# EAGLE design simplePDschematicsv1 (EAGLE 7.5.0)
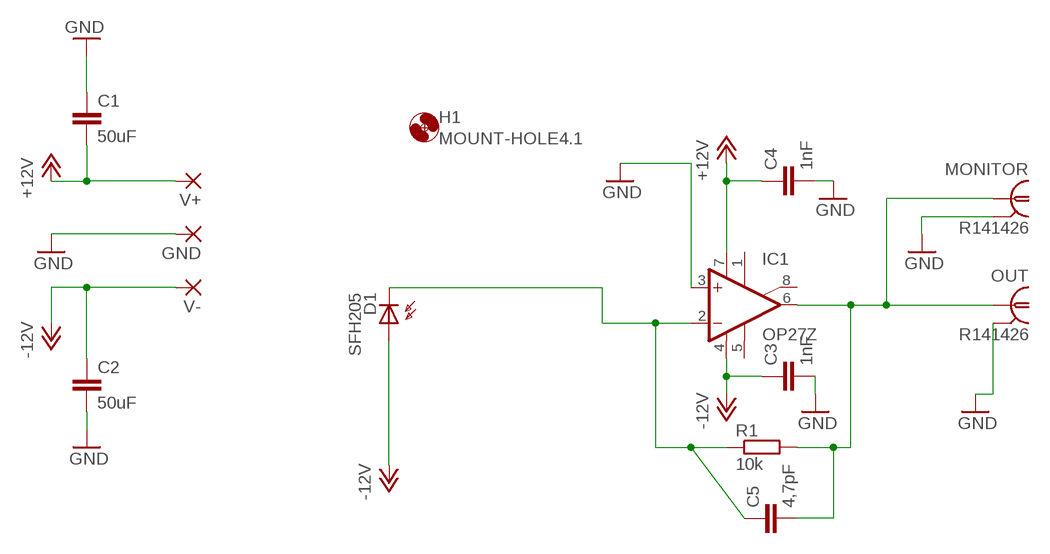
[diagram p0: schematic, sheet 1]

## Parts
C1  50uF  C-EU025-050X050  [C025-050X050]
C2  50uF  C-EU025-050X050  [C025-050X050]
C3  1nF  C-EU025-050X050  [C025-050X050]
C4  1nF  C-EU025-050X050  [C025-050X050]
C5  4,7pF  C-EU025-050X050  [C025-050X050]
D1  SFH205  [SFH205]
GND  1,6/0,9  [1,6/0,9]
H1  MOUNT-HOLE4.1  [4,1]
IC1  OP27Z  [DIL08]
MONITOR  R141426  [R141426]
OUT  R141426  [R141426]
R1  10k  R-EU_0207/5V  [0207/5V]
V+  1,6/0,9  [1,6/0,9]
V-  1,6/0,9  [1,6/0,9]

## Nets
GND: C1.1 C2.2 C3.2 C4.2 GND.1(P) IC1.3(+IN) MONITOR.2 MONITOR.3 MONITOR.4 MONITOR.5 OUT.2 OUT.3 OUT.4 OUT.5
N$1: C5.1 D1.K(C) IC1.2(-IN) R1.1
N$2: C5.2 IC1.6(OUT) MONITOR.1 OUT.1 R1.2
V+: C1.2 C4.1 IC1.7(V+) V+.1(P) ; supply symbol labelled +12V
V-: C2.1 C3.1 D1.A IC1.4(V-) V-.1(P) ; supply symbol labelled -12V
Unconnected: IC1.1(ON1) IC1.5(OPT) IC1.8(ON2)

## Library data of the parts
C1-C5 = resistor:C-EU: CAPACITOR, European symbol
D1 = opto-trans-siemens:SFH205: PHOTO DIODE; OC_FARNELL: unknown; OC_NEWARK: unknown
GND V+ V- = wirepad:1,6/0,9: THROUGH-HOLE PAD
H1 = holes:MOUNT-HOLE: MOUNTING HOLE with drill center marker
IC1 = linear:OP27: OP AMP
MONITOR OUT = con-coax:R141426: BNC COAX CONNECTOR Radiall 50/75 Ohm Spoerle; MF: FARNELL; MPN: R141426161; OC_FARNELL: 4195115; OC_NEWARK: 14J7919
R1 = resistor:R-EU_: RESISTOR, European symbol

## Board
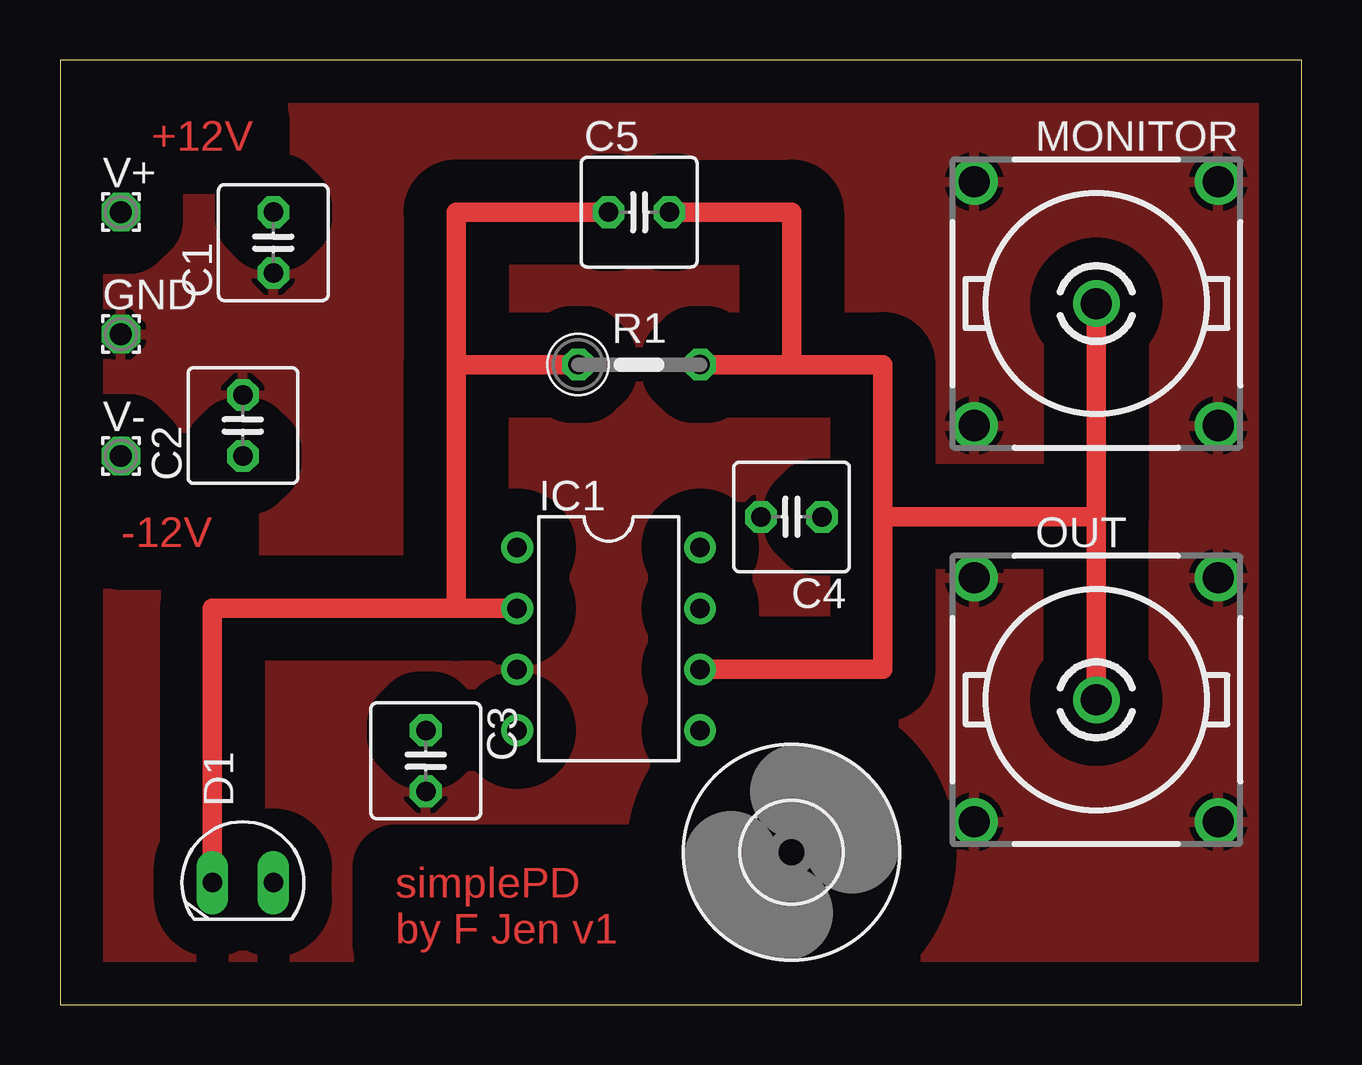
[diagram p1: board, top side]
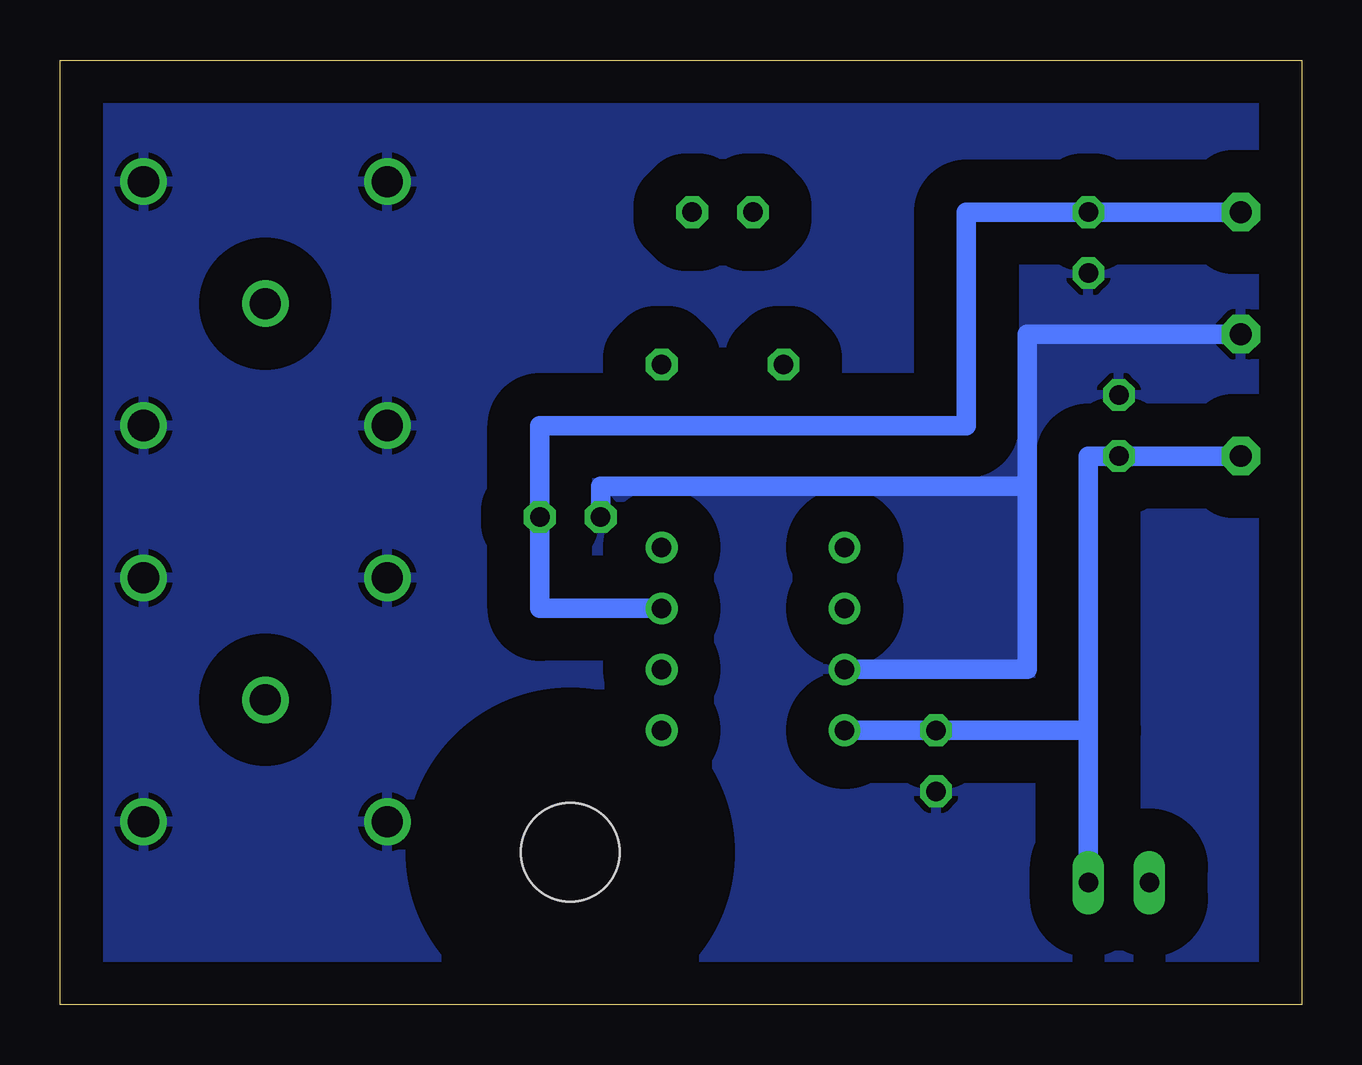
[diagram p2: board, bottom side, seen from below]

Size 51.74 x 39.36 mm. Coordinates in mm from the lower left corner, seen from the top.
Outline: 0,0 51.74,0 51.74,39.36 0,39.36 0,0
Copper layers (1*16): Top 0.035mm / dielectric 1.5mm / Bottom 0.035mm
Design rules "default": minimum track width 10mil, minimum drill 24mil, track to track 8mil, track to pad 8mil, pad to pad 8mil, via to via 8mil, smd to smd 8mil, copper to edge 40mil, drill to drill 8mil, minimum pad ring 10mil, minimum via ring 8mil, stop-mask expansion 4mil, vias tented up to drill 0mil, thermal gap 10mil

### Footprints (pad centres in the part's own frame; a part is rotated, then mirrored left to right if it is on the bottom)
C025-050X050 = drill 0.813 octagon: 1 -1.27,0; 2 1.27,0
SFH205 = drill 0.813 long: A 0,-1.27; K 0,1.27
1,6/0,9 = drill 0.914 pad 1.6 octagon: 1 0,0
4,1 = hole 4.1: 0,0
DIL08 = drill 0.813 pad 1.27: 1 -3.81,-3.81; 2 -1.27,-3.81; 3 1.27,-3.81; 4 3.81,-3.81; 5 3.81,3.81; 6 1.27,3.81; 7 -1.27,3.81; 8 -3.81,3.81
R141426 = drill 1.295: 1 0,0; 2 5.08,5.08; 3 -5.08,5.08; 4 -5.08,-5.08; 5 5.08,-5.08
0207/5V = drill 0.813 octagon: 1 -2.54,0; 2 2.54,0

### Placement (x,y rotation side)
C1  8.89,31.75 90 top
C2  7.62,24.13 90 top
C3  15.24,10.16 270 top
C4  30.48,20.32 180 top
C5  24.13,33.02 0 top
D1  7.62,5.08 90 top
GND  2.54,27.94 0 top
H1  30.48,6.35 0 top
IC1  22.86,15.24 270 top
MONITOR  43.18,29.21 0 top
OUT  43.18,12.7 0 top
R1  24.13,26.67 0 top
V+  2.54,33.02 0 top
V-  2.54,22.86 0 top

### Tracks (layer width: path | path; a pad name or v marks a point on that pad's centre or on a via)
GND
  Bottom 0.813: IC1.3 11.43,13.97 11.43,21.59 | 11.43,21.59 11.43,27.94 GND.1 | C4.2 29.21,21.59 11.43,21.59
  pour Top (isolate 1.778): 0,39.37 52.07,39.37 52.07,0 0,0
  pour Bottom (isolate 1.778): 0,39.37 52.07,39.37 52.07,0 0,0
N$1
  Top 0.813: IC1.2 16.51,16.51 | 16.51,16.51 16.51,26.67 | 16.51,26.67 R1.1 | C5.1 16.51,33.02 16.51,26.67 | 16.51,16.51 6.35,16.51 D1.K
N$2
  Top 0.813: R1.2 30.48,26.67 | 30.48,26.67 34.29,26.67 34.29,20.32 | 34.29,20.32 34.29,13.97 IC1.6 | C5.2 30.48,33.02 30.48,26.67 | MONITOR.1 43.18,20.32 | OUT.1 43.18,20.32 | 43.18,20.32 34.29,20.32
V+
  Bottom 0.813: V+.1 C1.2 13.97,33.02 13.97,24.13 31.75,24.13 C4.1 31.75,16.51 IC1.7
V-
  Bottom 0.813: IC1.4 C3.1 8.89,11.43 | V-.1 C2.1 8.89,22.86 8.89,11.43 | D1.A 8.89,11.43

### Text on the board
Top: +12V | -12V | simplePD / by F Jen v1